# Altium schematic sheet originalPSU.SchDoc
size Tabloid; SheetNumber: 9; SheetTotal: 10
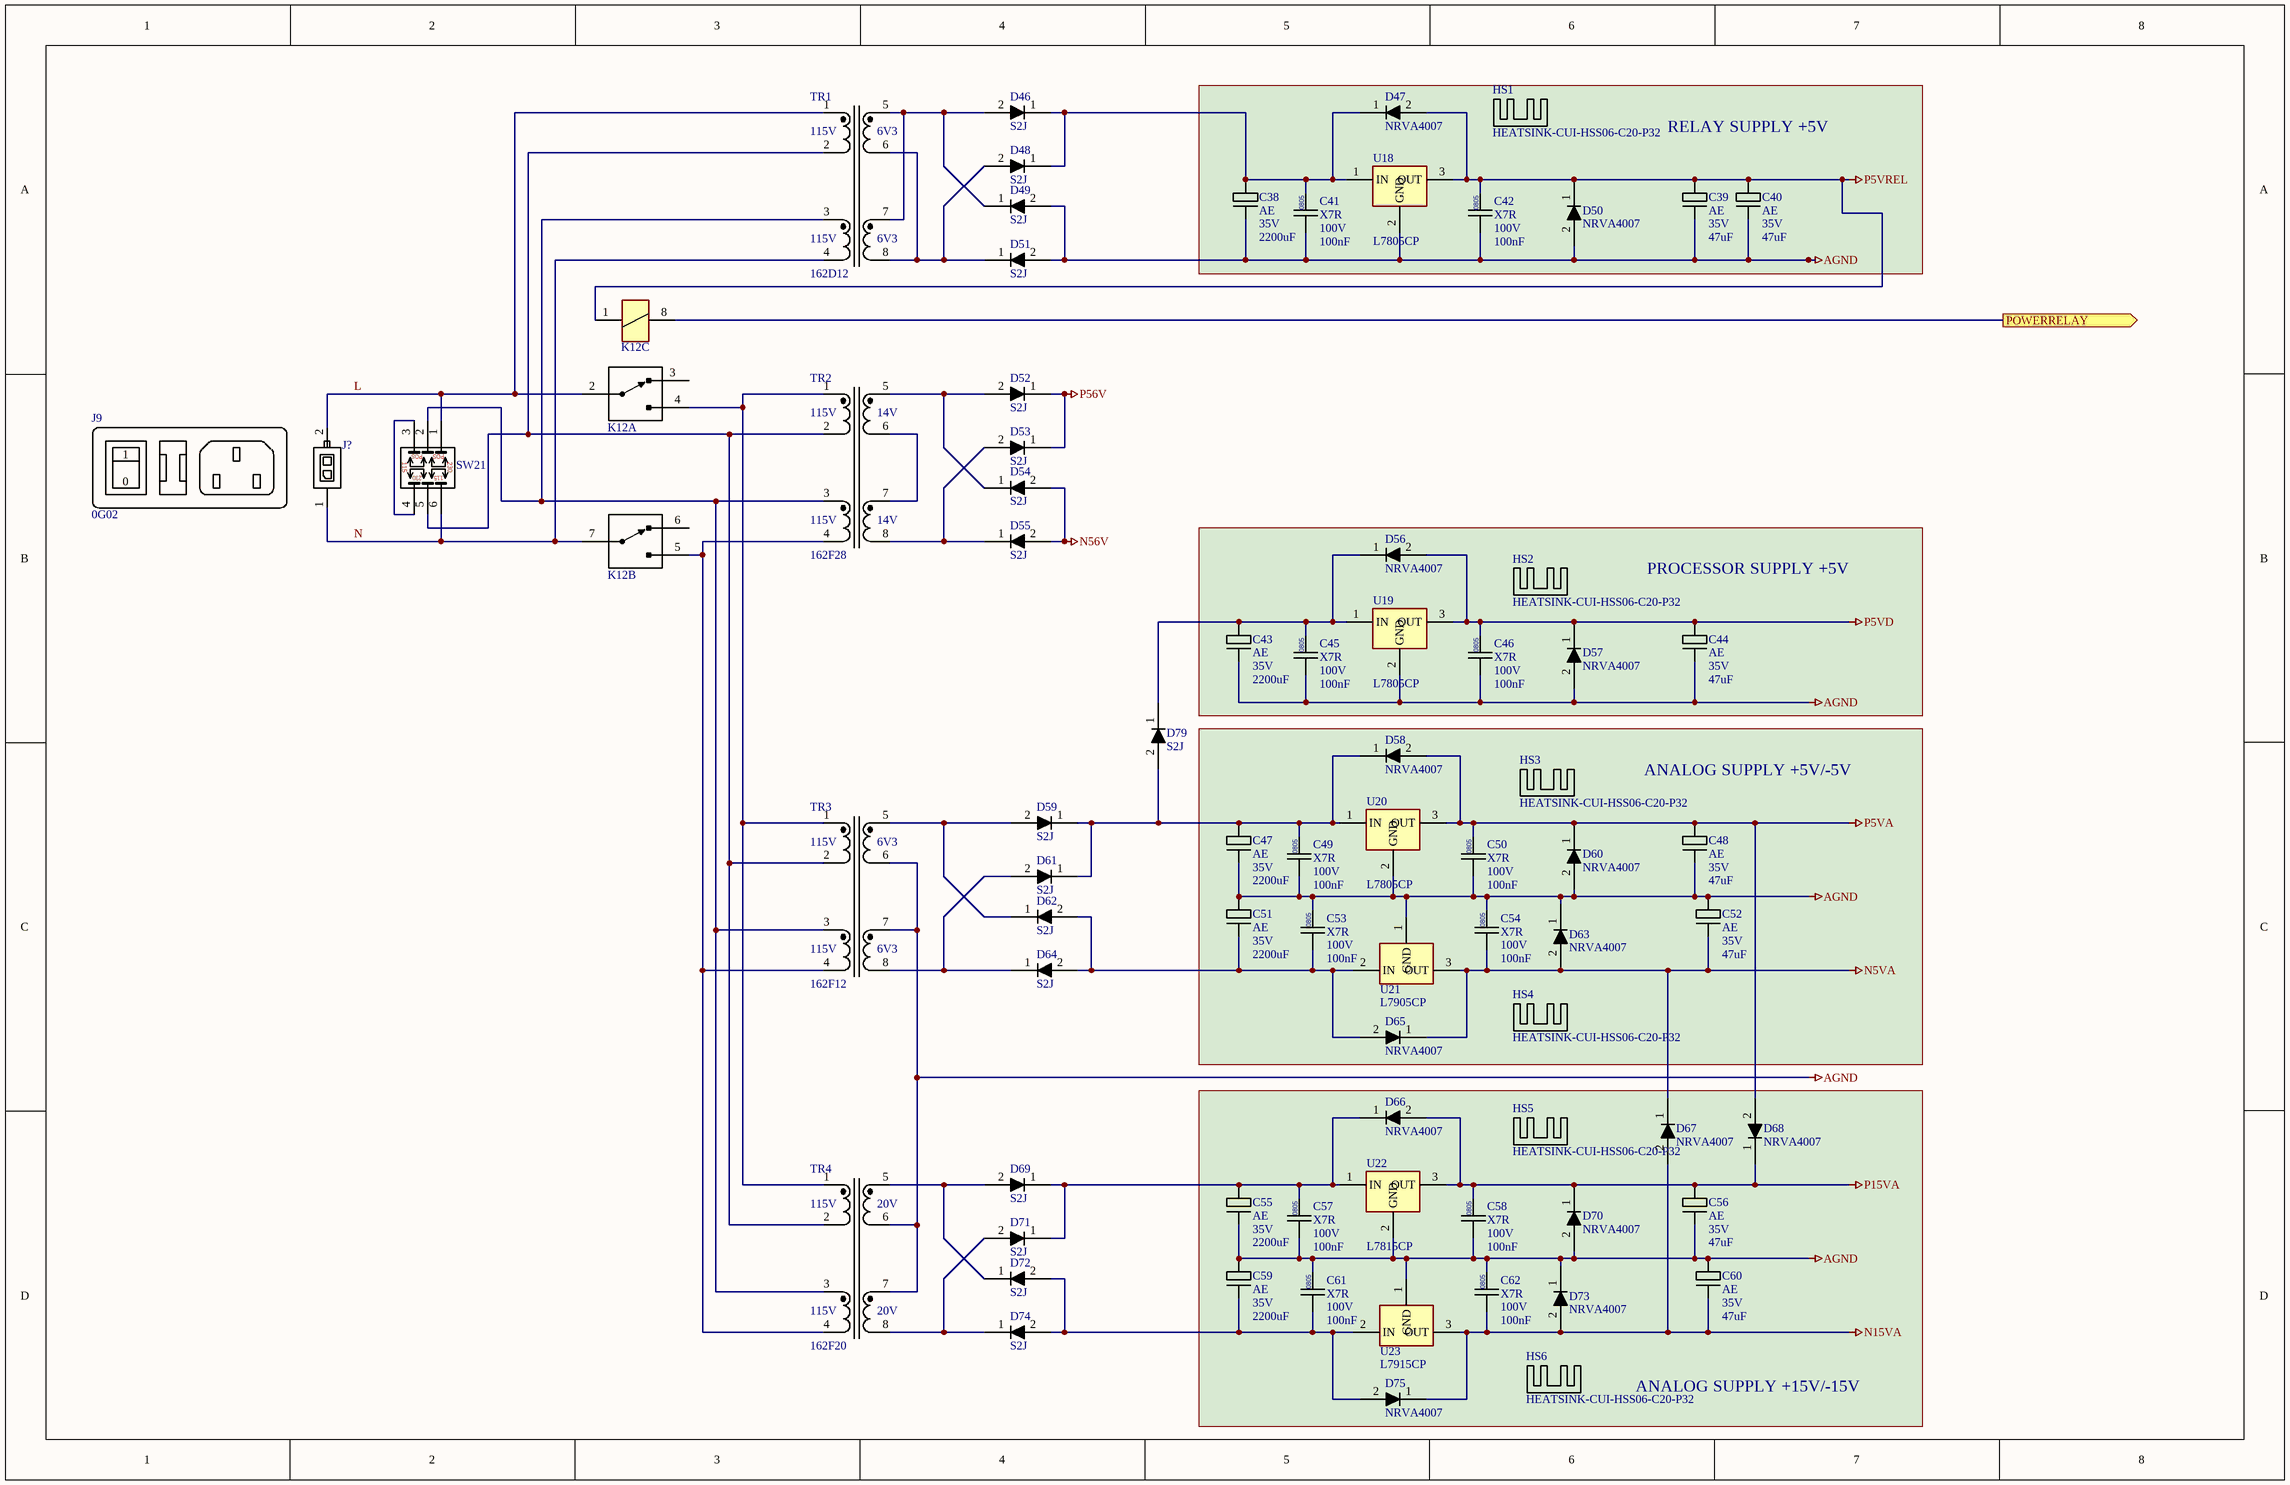
[diagram p0: originalPSU.SchDoc]

## Parts
C38  Dielectric: AE  Voltage: 35V  Capacitance: 2200uF  [CAPAE-RUBYCON-35ZLH2200MEFC16X25]  (hidden comment: CAP0603)
C39  Dielectric: AE  Voltage: 35V  Capacitance: 47uF  [CAPAE-KEMET-ESW476M035AE3AA]  (hidden comment: CAP0603)
C40  Dielectric: AE  Voltage: 35V  Capacitance: 47uF  [CAPAE-KEMET-ESW476M035AE3AA]  (hidden comment: CAP0603)
C41  Dielectric: X7R  Voltage: 100V  Capacitance: 100nF  [CAPC0805]  (hidden comment: CAP0805)
C42  Dielectric: X7R  Voltage: 100V  Capacitance: 100nF  [CAPC0805]  (hidden comment: CAP0805)
C43  Dielectric: AE  Voltage: 35V  Capacitance: 2200uF  [CAPAE-RUBYCON-35ZLH2200MEFC16X25]  (hidden comment: CAP0603)
C44  Dielectric: AE  Voltage: 35V  Capacitance: 47uF  [CAPAE-KEMET-ESW476M035AE3AA]  (hidden comment: CAP0603)
C45  Dielectric: X7R  Voltage: 100V  Capacitance: 100nF  [CAPC0805]  (hidden comment: CAP0805)
C46  Dielectric: X7R  Voltage: 100V  Capacitance: 100nF  [CAPC0805]  (hidden comment: CAP0805)
C47  Dielectric: AE  Voltage: 35V  Capacitance: 2200uF  [CAPAE-RUBYCON-35ZLH2200MEFC16X25]  (hidden comment: CAP0603)
C48  Dielectric: AE  Voltage: 35V  Capacitance: 47uF  [CAPAE-KEMET-ESW476M035AE3AA]  (hidden comment: CAP0603)
C49  Dielectric: X7R  Voltage: 100V  Capacitance: 100nF  [CAPC0805]  (hidden comment: CAP0805)
C50  Dielectric: X7R  Voltage: 100V  Capacitance: 100nF  [CAPC0805]  (hidden comment: CAP0805)
C51  Dielectric: AE  Voltage: 35V  Capacitance: 2200uF  [CAPAE-RUBYCON-35ZLH2200MEFC16X25]  (hidden comment: CAP0603)
C52  Dielectric: AE  Voltage: 35V  Capacitance: 47uF  [CAPAE-KEMET-ESW476M035AE3AA]  (hidden comment: CAP0603)
C53  Dielectric: X7R  Voltage: 100V  Capacitance: 100nF  [CAPC0805]  (hidden comment: CAP0805)
C54  Dielectric: X7R  Voltage: 100V  Capacitance: 100nF  [CAPC0805]  (hidden comment: CAP0805)
C55  Dielectric: AE  Voltage: 35V  Capacitance: 2200uF  [CAPAE-RUBYCON-35ZLH2200MEFC16X25]  (hidden comment: CAP0603)
C56  Dielectric: AE  Voltage: 35V  Capacitance: 47uF  [CAPAE-KEMET-ESW476M035AE3AA]  (hidden comment: CAP0603)
C57  Dielectric: X7R  Voltage: 100V  Capacitance: 100nF  [CAPC0805]  (hidden comment: CAP0805)
C58  Dielectric: X7R  Voltage: 100V  Capacitance: 100nF  [CAPC0805]  (hidden comment: CAP0805)
C59  Dielectric: AE  Voltage: 35V  Capacitance: 2200uF  [CAPAE-RUBYCON-35ZLH2200MEFC16X25]  (hidden comment: CAP0603)
C60  Dielectric: AE  Voltage: 35V  Capacitance: 47uF  [CAPAE-KEMET-ESW476M035AE3AA]  (hidden comment: CAP0603)
C61  Dielectric: X7R  Voltage: 100V  Capacitance: 100nF  [CAPC0805]  (hidden comment: CAP0805)
C62  Dielectric: X7R  Voltage: 100V  Capacitance: 100nF  [CAPC0805]  (hidden comment: CAP0805)
D46  S2J  [DO214AC]
D47  NRVA4007  [DO214AC]
D48  S2J  [DO214AC]
D49  S2J  [DO214AC]
D50  NRVA4007  [DO214AC]
D51  S2J  [DO214AC]
D52  S2J  [DO214AC]
D53  S2J  [DO214AC]
D54  S2J  [DO214AC]
D55  S2J  [DO214AC]
D56  NRVA4007  [DO214AC]
D57  NRVA4007  [DO214AC]
D58  NRVA4007  [DO214AC]
D59  S2J  [DO214AC]
D60  NRVA4007  [DO214AC]
D61  S2J  [DO214AC]
D62  S2J  [DO214AC]
D63  NRVA4007  [DO214AC]
D64  S2J  [DO214AC]
D65  NRVA4007  [DO214AC]
D66  NRVA4007  [DO214AC]
D67  NRVA4007  [DO214AC]
D68  NRVA4007  [DO214AC]
D69  S2J  [DO214AC]
D70  NRVA4007  [DO214AC]
D71  S2J  [DO214AC]
D72  S2J  [DO214AC]
D73  NRVA4007  [DO214AC]
D74  S2J  [DO214AC]
D75  NRVA4007  [DO214AC]
D79  S2J  [DO214AC]
HS1  HEATSINK-CUI-HSS06-C20-P32  [HEATSINK-CUI-HSS06-C20-P32]
HS2  HEATSINK-CUI-HSS06-C20-P32  [HEATSINK-CUI-HSS06-C20-P32]
HS3  HEATSINK-CUI-HSS06-C20-P32  [HEATSINK-CUI-HSS06-C20-P32]
HS4  HEATSINK-CUI-HSS06-C20-P32  [HEATSINK-CUI-HSS06-C20-P32]
HS5  HEATSINK-CUI-HSS06-C20-P32  [HEATSINK-CUI-HSS06-C20-P32]
HS6  HEATSINK-CUI-HSS06-C20-P32  [HEATSINK-CUI-HSS06-C20-P32]
J9  0G02  (mechanical)
J?  CONNECTOR-MOLEX-43045-0202  (value not drawn)
K12  RELAY-CIT-J104B2C5VDC.20S  [RELAY-CIT-J104B2C5VDC.20S]  (value not drawn)  (parts A,B,C of 3)
SW21  SWITCH,2 POLE, 2 SELECT  [SWITCH-CANDK-S602131MS02Q]  (value not drawn)
TR1  162D12  [XFMR-HAMMOND-162D12]
TR2  162F28  [XFMR-HAMMOND-162F28]
TR3  162F12  [XFMR-HAMMOND-162F12]
TR4  162F20  [XFMR-HAMMOND-162F20]
U18  L7805CP  [TO220V-OVERMOLD]
U19  L7805CP  [TO220V-OVERMOLD]
U20  L7805CP  [TO220V-OVERMOLD]
U21  L7905CP  [TO220V-OVERMOLD]
U22  L7815CP  [TO220V-OVERMOLD]
U23  L7915CP  [TO220V-OVERMOLD]

## Blocks framed on the sheet
RELAY SUPPLY +5V: C38-C42 D47 D50 HS1 U18
PROCESSOR SUPPLY +5V: C43-C46 D56 D57 HS2 U19
ANALOG SUPPLY +5V/-5V: C47-C54 D58 D60 D63 D65 HS3 HS4 U20 U21
ANALOG SUPPLY +15V/-15V: C55-C62 D66-D68 D70 D73 D75 HS5 HS6 U22 U23

## Ports
POWERRELAY (out)

## Nets
AGND: C38.2 C39.2 C40.2 C41.2 C42.2 C43.2 C44.2 C45.2 C46.2 C47.2 C48.2 C49.2 C50.2 C51.1 C52.1 C53.1 C54.1 C55.2 C56.2 C57.2 C58.2 C59.1 C60.1 C61.1 C62.1 D49.2(A) D50.2(A) D51.2(A) D57.2(A) D60.2(A) D63.1(K) D70.2(A) D73.1(K) TR3.6 TR3.7 TR4.6 TR4.7 U18.2(GND) U19.2(GND) U20.2(GND) U21.1(GND) U22.2(GND) U23.1(GND)
N5VA: C52.2 C54.2 D63.2(A) D65.1(K) D67.1(K) U21.3(OUT)
N15VA: C60.2 C62.2 D67.2(A) D73.2(A) D75.1(K) U23.3(OUT)
N56V: D54.2(A) D55.2(A)
P5VA: C48.1 C50.1 D58.2(A) D60.1(K) D68.2(A) U20.3(OUT)
P5VD: C44.1 C46.1 D56.2(A) D57.1(K) U19.3(OUT)
P5VREL: C39.1 C40.1 C42.1 D47.2(A) D50.1(K) K12.1 U18.3(OUT)
P15VA: C56.1 C58.1 D66.2(A) D68.1(K) D70.1(K) U22.3(OUT)
P56V: D52.1(K) D53.1(K)
L: J?.2 K12.2(NC) SW21.1 TR1.1
N: J?.1 K12.7(NC) SW21.6 TR1.4
POWERRELAY: K12.8 ; port POWERRELAY
NetC38_1: C38.1 C41.1 D46.1(K) D47.1(K) D48.1(K) U18.1(IN)
NetC43_1: C43.1 C45.1 D56.1(K) D79.1(K) U19.1(IN)
NetC47_1: C47.1 C49.1 D58.1(K) D59.1(K) D61.1(K) D79.2(A) U20.1(IN)
NetC51_2: C51.2 C53.2 D62.2(A) D64.2(A) D65.2(A) U21.2(IN)
NetC55_1: C55.1 C57.1 D66.1(K) D69.1(K) D71.1(K) U22.1(IN)
NetC59_2: C59.2 C61.2 D72.2(A) D74.2(A) D75.2(A) U23.2(IN)
NetD46_2: D46.2(A) D49.1(K) TR1.5 TR1.7
NetD48_2: D48.2(A) D51.1(K) TR1.6 TR1.8
NetD52_2: D52.2(A) D54.1(K) TR2.5
NetD53_2: D53.2(A) D55.1(K) TR2.8
NetD59_2: D59.2(A) D62.1(K) TR3.5
NetD61_2: D61.2(A) D64.1(K) TR3.8
NetD69_2: D69.2(A) D72.1(K) TR4.5
NetD71_2: D71.2(A) D74.1(K) TR4.8
NetK12_4: K12.4(NO) TR2.1 TR3.1 TR4.1
NetK12_5: K12.5(NO) TR2.4 TR3.4 TR4.4
NetSW21_2: SW21.2 TR1.3 TR2.3 TR3.3 TR4.3
NetSW21_3: SW21.3 SW21.4
NetSW21_5: SW21.5 TR1.2 TR2.2 TR3.2 TR4.2
NetTR2_6: TR2.6 TR2.7

Not connected (* = marked no-connect by the designer): K12 3(COM) 6(COM)

## Notes on the sheet
- (in symbol CAPC-0805-100nF-100V) 0805
- (in symbol CONN-DELTA-0G02) 1; 0
- (in symbol SWITCH-CANDK-S602131MS02Q) POS; 115; 230
- (in symbol XFMR-HAMMOND-162D12) 115V; 6V3
- (in symbol XFMR-HAMMOND-162F12) 115V; 6V3
- (in symbol XFMR-HAMMOND-162F20) 115V; 20V
- (in symbol XFMR-HAMMOND-162F28) 115V; 14V

## Library data of the parts
C38 C43 C47 C51 C55 C59 = CAPP-AE-2200uF-35V-TH075P160D270H: CAPACITOR,ALU,2200uF,35V,TH,P7.5mm,D16mm,H27mm; Manufacturer 1: RUBYCON; Manufacturer Part Number 1: 35ZLH2200MEFC16X25; Location: *; DIGIKEY: 1189-2266-ND
C39 C40 C44 C48 C52 C56 C60 = CAPP-AE-47uF-35V-TH025P063D125H: CAPACITOR,ALU,47uF,35V,TH,P0.25mm,D6.3mm,H12.5mm; Manufacturer 1: KEMET; Manufacturer Part Number 1: ESW476M035AE3AA; Location: *
C41 C42 C45 C46 C49 C50 C53 C54 C57 C58 C61 C62 = CAPC-0805-100nF-100V: CAPACITOR,CERAMIC,100nF,100V,X7R,0805; Package / Case: 0805 (2012 metric); Location: *
D46 D48 D49 D51-D55 D59 D61 D62 D64 D69 D71 D72 D74 D79 = DIODE-RECTIFIER-DIOTEC-S2J: DIODE,RECTIFIER,600V,2A,S2J,DO214AA(SMB); Manufacturer 1: DIOTEC; DIGIKEY: 4878-S2JCT-ND; Manufacturer Part Number 1: S2J; MOUSER: 637-SK115
D47 D50 D56-D58 D60 D63 D65-D68 D70 D73 D75 = DIODE-ONSEMI-NRVA4007T3G: DIODE,RECTIFIER,1000V,1A,ONSEMI,NRVA4007,SMA; DIGIKEY: NRVA4007T3GOSCT-ND; Manufacturer 1: ONSEMI; Manufacturer Part Number 1: NRVA4007T3G
HS1-HS6 = HEATSINK-CUI-HSS06-C20-P32: HEATSINKSTAMPED,CLIP-ON,BOARDMOUNT,3W,25C/W,CUI,HSS06-C20-P32
J9 = CONN-DELTA-0G02: CONN,POWER,IEC,SWITCH,FUSE ASSEMBLY,PANELMOUNT
J? = CONN-MOLEX-430450214: CONN,1X2,MOLEX, MICROFIT,VERT
K12 = RELAY-CIT-J104B2C5VDC.20S: RELAY,DPDT,5V COIL,250VAC,3A; Manufacturer 1: CIT; DIGIKEY: 2449-J104B2C5VDC.20S-ND; Manufacturer Part Number 1: J104B2C5VDC.20S
SW21 = SWITCH-CANDK-S602131MS02Q: SWITCH,DPDT,250/115,C&K,S602131MS02Q; Manufacturer Part Number 1: S202121MS02Q; DIGIKEY: CKC5115-ND OR CKN10661-ND; Manufacturer 1: C&K
TR1 = XFMR-HAMMOND-162D12: XFMR,115/230,2X6V3,1.16A,HAMMOND,162F12
TR2 = XFMR-HAMMOND-162F28: XFMR,115/230,2X14,6VA,HAMMOND,162F28
TR3 = XFMR-HAMMOND-162F12: XFMR,115/230,2X6V3,6VA,HAMMOND,162F12
TR4 = XFMR-HAMMOND-162F20: XFMR,115/230,2X20,6VA,HAMMOND,162F20
U18-U20 = IC-ST-L7805CP-TO220FP: IC,VOLTAGE REG,LIN,POSITIVE,5V,7805,TO220 FULLPACK; LCSC: C460608
U21 = IC-ST-L7905CP-TO220FP: IC,VOLTAGE REG,LIN,NEGATIVE,-5V,7905,TO220 FULLPACK; LCSC: C460608
U22 = IC-ST-L7815CP-TO220FP: IC,VOLTAGE REG,LIN,POSITIVE,15V,7815,TO220 FULLPACK; LCSC: C460608
U23 = IC-ST-L7915CP-TO220FP: IC,VOLTAGE REG,LIN,NEGATIVE,-15V,7915,TO220 FULLPACK; LCSC: C460608